# EAGLE design board_down (EAGLE 5.10)
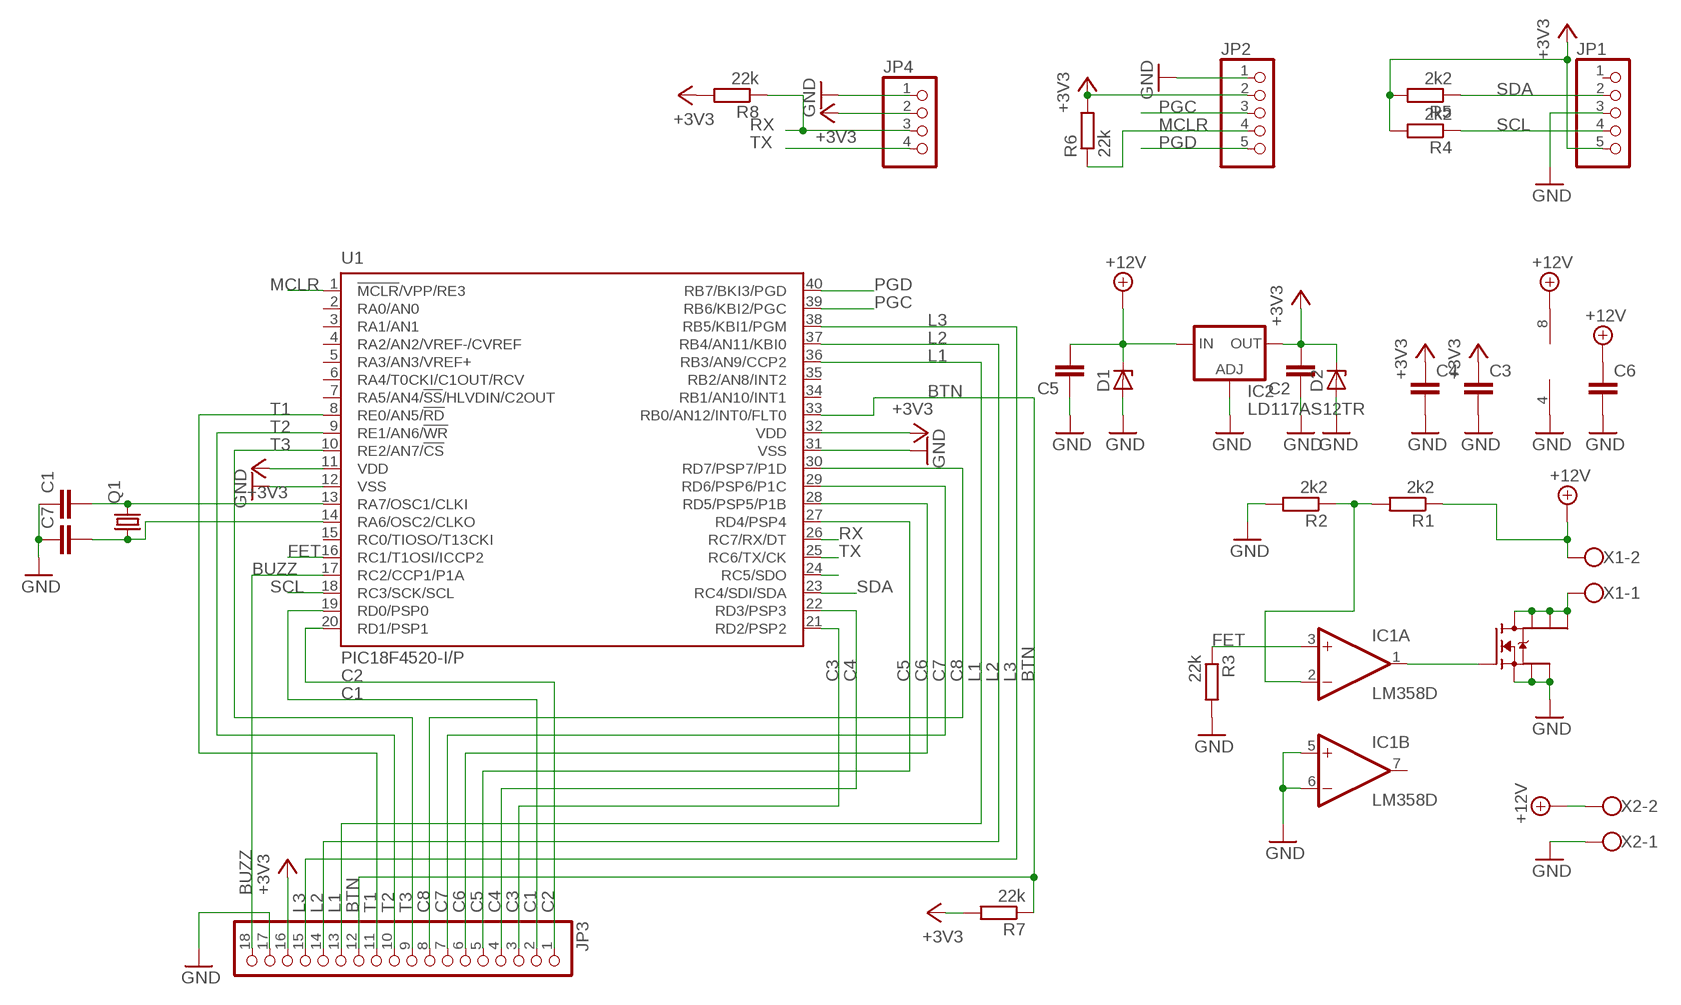
[diagram p0: schematic, sheet 1]

## Parts
C1  C-EUC0805  [C0805]
C2  C-EUC1206  [C1206]
C3  C-EUC0805  [C0805]
C4  C-EUC0805  [C0805]
C5  C-EUC1206  [C1206]
C6  C-EUC0805  [C0805]
C7  C-EUC0805  [C0805]
D1  ZENER-DIODESMB  [SMB]
D2  ZENER-DIODESMB  [SMB]
IC1  LM358D  [SO08]
IC2  LD117AS12TR  [SOT223]
JP1  PINHD-1X5  [1X05]
JP2  PINHD-1X5  [1X05]
JP3  PINHD-1X18  [1X18]
JP4  PINHD-1X4  [1X04]
Q1  CRYSTALHC49S  [HC49/S]
R1  2k2  R-EU_R0805  [R0805]
R2  2k2  R-EU_R0805  [R0805]
R3  22k  R-EU_R0805  [R0805]
R4  2k2  R-EU_R0805  [R0805]
R5  2k2  R-EU_R0805  [R0805]
R6  22k  R-EU_R0805  [R0805]
R7  22k  R-EU_R0805  [R0805]
R8  22k  R-EU_R0805  [R0805]
U1  PIC18F4520-I/P  [DIL40]
U$1  IRF8788  [SO8]
X1  W237-02P  [W237-132]
X2  W237-02P  [W237-132]

## Nets
+3V3: C2.2 C3.1 C4.1 D2.C IC2.4(OUT) JP1.5 JP2.2 JP3.16 JP4.2 R4.2 R5.2 R6.2 R7.2 R8.2 U1.11(VDD) U1.32(VDD)
+12V: C5.2 C6.1 D1.C IC1.8(P:V+) IC2.3(IN) R1.1 X1.2 X2.2
BTN: JP3.12 R7.1 U1.33(RB0/AN12/INT0/FLT0)
BUZZ: JP3.18 U1.17(RC2/CCP1/P1A)
C1: JP3.2 U1.19(RD0/PSP0)
C2: JP3.1 U1.20(RD1/PSP1)
C3: JP3.3 U1.21(RD2/PSP2)
C4: JP3.4 U1.22(RD3/PSP3)
C5: JP3.5 U1.27(RD4/PSP4)
C6: JP3.6 U1.28(RD5/PSP5/P1B)
C7: JP3.7 U1.29(RD6/PSP6/P1C)
C8: JP3.8 U1.30(RD7/PSP7/P1D)
FET: IC1.3(A:+IN) R3.1 U1.16(RC1/T1OSI/ICCP2)
GND: C1.1 C2.1 C3.2 C4.2 C5.1 C6.2 C7.1 D1.A D2.A IC1.4(P:V-) IC1.5(B:+IN) IC1.6(B:-IN) IC2.1(ADJ) JP1.3 JP2.1 JP3.17 JP4.1 R2.2 R3.2 U1.12(VSS) U1.31(VSS) U$1.1(S1) U$1.2(S2) U$1.3(S3) X2.1
L1: JP3.13 U1.36(RB3/AN9/CCP2)
L2: JP3.14 U1.37(RB4/AN11/KBI0)
L3: JP3.15 U1.38(RB5/KBI1/PGM)
MCLR: JP2.4 R6.1 U1.1(!MCLR!/VPP/RE3)
N$1: U1.24(RC5/SDO)
N$2: U$1.5(D4) U$1.6(D3) U$1.7(D2) U$1.8(D1) X1.1
N$3: IC1.1(A:OUT) U$1.4(G)
N$5: IC1.2(A:-IN) R1.2 R2.1
N$20: C1.2 Q1.2 U1.13(RA7/OSC1/CLKI)
N$21: C7.2 Q1.1 U1.14(RA6/OSC2/CLKO)
PGC: JP2.3 U1.39(RB6/KBI2/PGC)
PGD: JP2.5 U1.40(RB7/BKI3/PGD)
RX: JP4.3 R8.1 U1.26(RC7/RX/DT)
SCL: JP1.4 R4.1 U1.18(RC3/SCK/SCL)
SDA: JP1.2 R5.1 U1.23(RC4/SDI/SDA)
T1: JP3.11 U1.8(RE0/AN5/!RD)
T2: JP3.10 U1.9(RE1/AN6/!WR)
T3: JP3.9 U1.10(RE2/AN7/!CS)
TX: JP4.4 U1.25(RC6/TX/CK)
Unconnected: IC1.7(B:OUT) JP1.1 U1.2(RA0/AN0) U1.3(RA1/AN1) U1.4(RA2/AN2/VREF-/CVREF) U1.5(RA3/AN3/VREF+) U1.6(RA4/T0CKI/C1OUT/RCV) U1.7(RA5/AN4/!SS!/HLVDIN/C2OUT) U1.15(RC0/TIOSO/T13CKI) U1.34(RB1/AN10/INT1) U1.35(RB2/AN8/INT2)

## Library data of the parts
C1-C7 = rcl:C-EU: CAPACITOR, European symbol
D1 D2 = diode:ZENER-DIODE: Z-Diode
IC1 = linear:LM358: OP AMP also LM158; LM258; LM2904 Source: http://cache.national.com/ds/LM/LM158.pdf
IC2 = v-reg:LD117A?*: Low drop fixed and adjustable positive voltage regulators 1 A Source: http://www.st.com/stonline/products/literature/ds/7194/ld1117axx.pdf
JP1 JP2 = pinhead:PINHD-1X5: PIN HEADER
JP3 = pinhead:PINHD-1X18: PIN HEADER
JP4 = pinhead:PINHD-1X4: PIN HEADER
Q1 = crystal:CRYSTAL: CRYSTAL
R1-R8 = rcl:R-EU_: RESISTOR, European symbol
U1 = microchip-pic18:PIC18F4*20: Microcontrollers with nanoWatt Technology High-Performance, Enhanced Flash, 28/40/44-Pin,
U$1 = _moja:IRF8788
X1 X2 = con-wago-508:W237-02P: WAGO SREW CLAMP

## Board
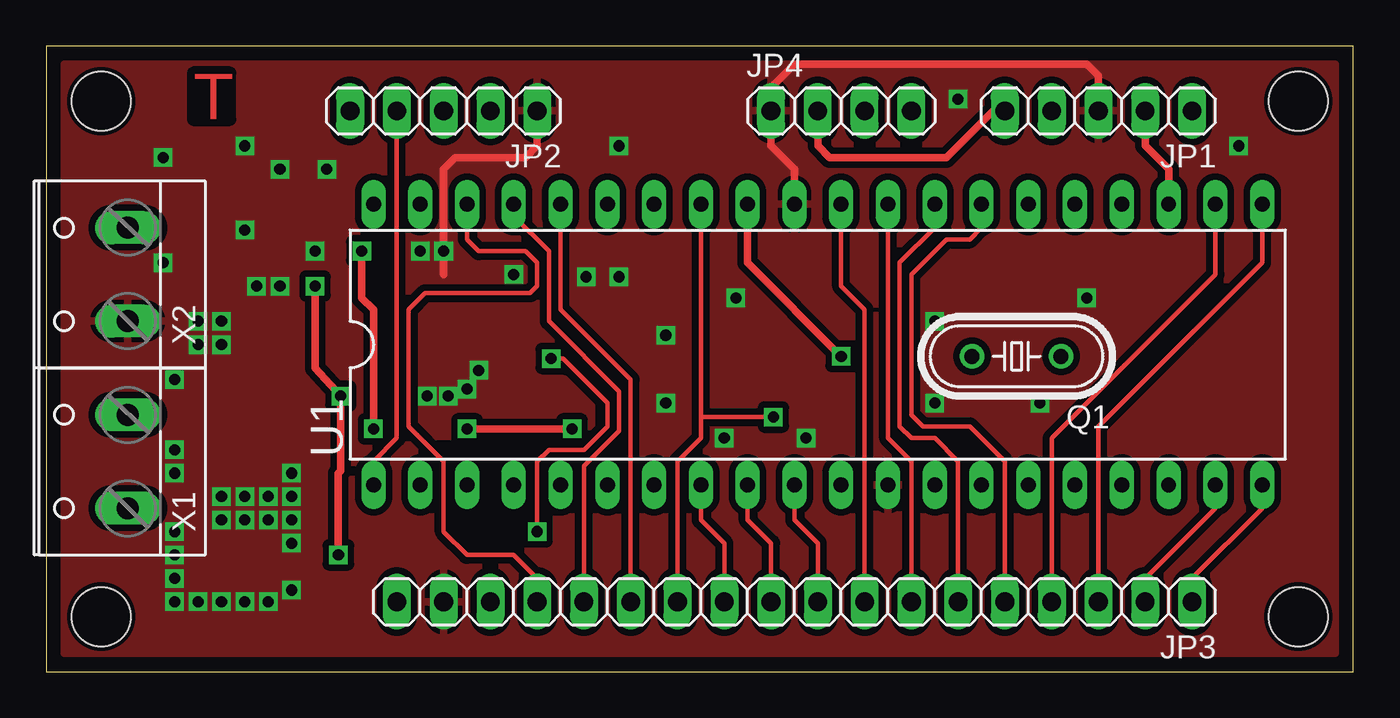
[diagram p1: board, top side]
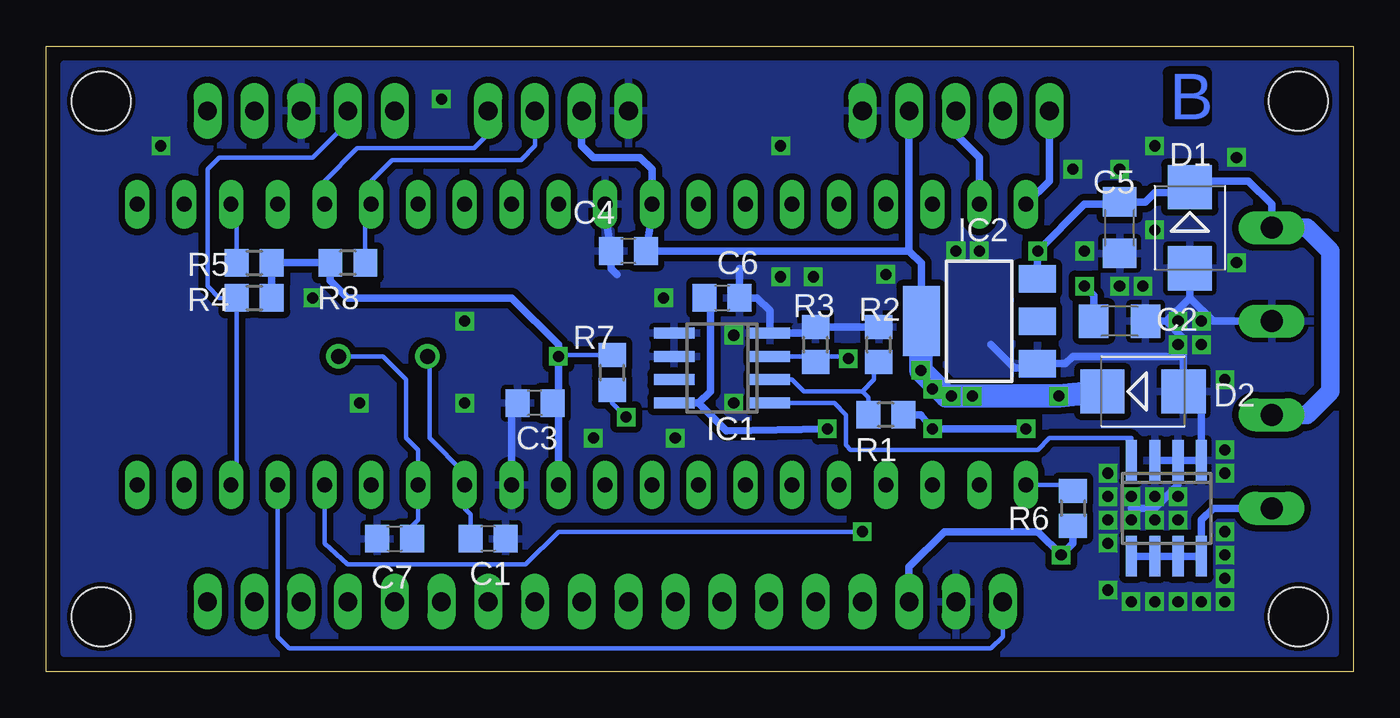
[diagram p2: board, bottom side, seen from below]

Size 71 x 34 mm. Coordinates in mm from the lower left corner, seen from the top.
Outline: 0,0 71,0 71,34 0,34 0,0
Copper layers (1*16): Top 0.035mm / dielectric 1.5mm / Bottom 0.035mm
Design rules "default *": minimum track width 8mil, minimum drill 23mil, track to track 14mil, track to pad 14mil, pad to pad 14mil, via to via 14mil, smd to smd 8mil, copper to edge 10mil, drill to drill 8mil, minimum pad ring 10mil, minimum via ring 8mil, stop-mask expansion 4mil, vias tented up to drill 0mil, thermal gap 10mil
Holes 3.2 mm at 3,3 68,3 3,31 68,31

### Footprints (pad centres in the part's own frame; a part is rotated, then mirrored left to right if it is on the bottom)
C0805 = smd 1.3 x 1.5: 1 -0.95,0; 2 0.95,0
C1206 = smd 1.6 x 1.8: 1 -1.4,0; 2 1.4,0
SMB = smd 2.4 x 2.4: A 2.2,0; C -2.2,0
SO08 = smd 0.6 x 2.2: 1 -1.905,-2.6; 2 -0.635,-2.6; 3 0.635,-2.6; 4 1.905,-2.6; 5 1.905,2.6; 6 0.635,2.6; 7 -0.635,2.6; 8 -1.905,2.6
SOT223 = smd 1.5 x 2: 1 -2.3,-3.15; 2 0,-3.15; 3 2.3,-3.15 | smd 3.8 x 2: 4 0,3.15
1X05 = drill 1.016 long: 1 -5.08,0; 2 -2.54,0; 3 0,0; 4 2.54,0; 5 5.08,0
1X18 = drill 1.016 long: 1 -21.59,0; 2 -19.05,0; 3 -16.51,0; 4 -13.97,0; 5 -11.43,0; 6 -8.89,0; 7 -6.35,0; 8 -3.81,0; 9 -1.27,0; 10 1.27,0; 11 3.81,0; 12 6.35,0; 13 8.89,0; 14 11.43,0; 15 13.97,0; 16 16.51,0; 17 19.05,0; 18 21.59,0
1X04 = drill 1.016 long: 1 -3.81,0; 2 -1.27,0; 3 1.27,0; 4 3.81,0
HC49/S = drill 0.813 round: 1 -2.413,0; 2 2.413,0
R0805 = smd 1.3 x 1.5: 1 -0.95,0; 2 0.95,0
DIL40 = drill 0.813 long: 1 -24.13,-7.62; 2 -21.59,-7.62; 3 -19.05,-7.62; 4 -16.51,-7.62; 5 -13.97,-7.62; 6 -11.43,-7.62; 7 -8.89,-7.62; 8 -6.35,-7.62; 9 -3.81,-7.62; 10 -1.27,-7.62; 11 1.27,-7.62; 12 3.81,-7.62; 13 6.35,-7.62; 14 8.89,-7.62; 15 11.43,-7.62; 16 13.97,-7.62; 17 16.51,-7.62; 18 19.05,-7.62; 19 21.59,-7.62; 20 24.13,-7.62; 21 24.13,7.62; 22 21.59,7.62; 23 19.05,7.62; 24 16.51,7.62; 25 13.97,7.62; 26 11.43,7.62; 27 8.89,7.62; 28 6.35,7.62; 29 3.81,7.62; 30 1.27,7.62; 31 -1.27,7.62; 32 -3.81,7.62; 33 -6.35,7.62; 34 -8.89,7.62; 35 -11.43,7.62; 36 -13.97,7.62; 37 -16.51,7.62; 38 -19.05,7.62; 39 -21.59,7.62; 40 -24.13,7.62
SO8 = smd 0.6 x 2.2: 1 -1.905,-2.6; 2 -0.635,-2.6; 3 0.635,-2.6; 4 1.905,-2.6; 5 1.905,2.6; 6 0.635,2.6; 7 -0.635,2.6; 8 -1.905,2.6
W237-132 = drill 1.194 long: 1 -2.54,-0.635; 2 2.54,-0.635

### Placement (x,y rotation side)
C1  46.99,7.24 180 bottom
C2  12.7,19.05 180 bottom
C3  44.45,14.61 180 bottom
C4  39.37,22.86 180 bottom
C5  12.7,24.13 90 bottom
C6  34.29,20.32 0 bottom
C7  52.07,7.24 0 bottom
D1  8.89,24.13 270 bottom
D2  11.43,15.24 0 bottom
IC1  34.29,16.51 90 bottom
IC2  20.32,19.05 90 bottom
JP1  57.15,30.48 180 top
JP2  21.59,30.48 180 top
JP3  40.64,3.81 180 top
JP4  43.18,30.48 0 top
Q1  52.7,17.14 180 top
R1  25.4,13.97 180 bottom
R2  25.78,17.78 90 bottom
R3  29.21,17.78 90 bottom
R4  59.69,20.32 0 bottom
R5  59.69,22.23 0 bottom
R6  15.24,8.89 270 bottom
R7  40.26,16.26 90 bottom
R8  54.61,22.23 180 bottom
U1  41.91,17.78 0 top
U$1  10.16,8.89 180 bottom
X1  3.81,11.43 90 top
X2  3.81,21.59 90 top

### Tracks (layer width: path | path; a pad name or v marks a point on that pad's centre or on a via)
+3V3  (via drill 0.6)
  Top 0.406: v14.61,20.95 14.61,16.51 v16,14.99 16,10.92 15.88,10.79 v15.88,6.35 | U1.32 38.1,22.23 v43.18,17.14 | JP1.5 51.44,30.48 48.9,27.94 42.55,27.94 41.91,28.57 JP4.2
  Bottom 0.254: R7.2 43.12,17.21 v43.18,17.14 | v21.84,14.99 22.86,14.99 v22.86,15.37
  Bottom 0.406: 23.5,19.02 IC2.4 23.47,22.2 24.13,22.86 | C2.2 14.1,20.45 v14.61,20.95 | 24.13,22.86 C4.1 | C4.1 38.1,23.18 | U1.11 43.18,14.29 C3.1 43.18,14.93 v43.18,17.14 43.18,17.78 45.72,20.32 54.61,20.32 55.56,21.27 R8.2 R5.2 R4.2 | C4.1 38.17,24.32 U1.32 38.1,27.3 38.73,27.94 41.27,27.94 41.91,28.57 JP4.2 | JP3.16 24.13,5.71 22.23,7.62 17.14,7.62 v15.88,6.35 15.24,6.99 R6.2 | 24.13,22.86 JP2.2
  Bottom 1.27: D2.C v16,14.99 v20.7,14.99 v21.84,14.99 22.1,14.99 v23.5,16.38 23.5,19.02
  pour Top: 20.83,20.19 20.32,19.68 20.32,12.7 29.72,12.7 29.72,14.48 28.19,16 28.07,16 27.81,16.26 27.81,19.94 27.56,20.19
+12V  (via drill 0.6)
  Top 0.406: v17.78,13.21 17.78,19.68 17.14,20.32 v17.14,22.86 | v22.86,13.21 v28.57,13.21
  Bottom 0.406: X2.2 4.45,25.4 5.71,26.67 8.55,26.67 D1.C 9.19,26.04 10.79,26.04 11.3,25.53 C5.2 13.21,25.4 14.61,25.4 v17.14,22.86 17.17,22.84 IC2.3 | 35.56,14.61 IC1.8 | 35.56,14.61 34.92,15.24 34.92,20 C6.1 | v17.78,13.21 v22.86,13.21 23.5,13.97 R1.1 | v28.57,13.21 34.04,13.08 35.56,14.61
  Bottom 1.016: X2.2 2.54,24.13 1.27,22.86 1.27,15.24 2.54,13.97 X1.2
BTN  (via drill 0.6)
  Top 0.254: 35.56,13.84 35.56,12.7 34.29,11.43 JP3.12 | 35.56,13.84 U1.33 | 35.56,13.84 v39.5,13.84
  Bottom 0.254: R7.1 40.26,14.61 v39.5,13.84
BUZZ
  Bottom 0.254: JP3.18 19.05,1.91 19.68,1.27 57.78,1.27 58.42,1.91 U1.17
C1
  Top 0.254: U1.19 63.5,8.89 59.69,5.08 JP3.2
C2
  Top 0.254: U1.20 66.04,8.89 62.23,5.08 JP3.1
C3
  Top 0.254: U1.21 66.04,22.23 57.15,13.34 JP3.3
C4
  Top 0.254: U1.22 63.5,21.59 54.61,12.7 JP3.4
C5
  Top 0.254: U1.27 50.8,24.13 50.16,23.5 48.9,23.5 46.99,21.59 46.99,13.97 47.62,13.34 50.16,13.34 50.8,12.7 52.07,11.43 JP3.5
C6
  Top 0.254: U1.28 48.26,24.13 46.35,22.23 46.35,13.34 46.99,12.7 48.26,12.7 49.53,11.43 JP3.6
C7
  Top 0.254: U1.29 45.72,12.7 46.99,11.43 JP3.7
C8
  Top 0.254: U1.30 43.18,20.95 44.45,19.68 JP3.8
FET  (via drill 0.6)
  Top 0.254: v27.43,17.02 28.07,17.02 30.48,14.61 30.48,13.34 29.21,12.06 27.3,12.06 26.67,11.43 v26.67,7.62
  Bottom 0.254: v27.43,17.02 27.43,17.14 29.52,17.14 IC1.3 | v26.67,7.62 43.18,7.62 44.96,5.84 54.61,5.84 55.88,6.99 U1.16
  Bottom 0.406: 29.52,17.14 R3.1
GND  (via drill 0.6)
  Top 0.406: U1.31 40.64,27.3 39.37,28.57 JP4.1 39.37,31.75 40.64,33.02 56.52,33.02 57.15,32.38 JP1.3 | JP2.1 26.67,28.57 26.04,27.94 22.23,27.94 21.59,27.3 21.59,21.59
  Bottom 0.406: X2.1 7.62,19.05 8.89,20.32 | 8.89,20.32 D1.A | 10.16,19.05 C2.1 | 10.16,19.05 8.89,20.32 | 9.23,17.14 D2.A 8.26,14.27 U$1.1 U$1.2 | 9.23,17.14 9.23,18.12 10.16,19.05 | U$1.2 U$1.3 | 9.23,17.14 15.24,17.14 15.63,16.75 IC2.1 17.41,16.51 18.41,16.51 19.68,17.78 | 40.01,21.59 40.32,21.91 C4.2 40.57,24.45 U1.31 | 33.34,21.91 C6.2 32.38,20.32 31.69,19.62 IC1.4 29.52,18.41 R3.2 R2.2 | U1.12 45.72,14.29 C3.2 | 12.06,8.89 10.79,8.89 9.53,10.16 U$1.2
  other vias: 25.4,21.59 20.32,22.86 9.53,9.53 10.79,9.53 12.06,9.53 13.34,9.53 13.34,10.79 6.99,15.88 8.26,17.78 9.53,19.05 11.43,20.95 12.7,20.95 15.24,27.3 12.7,27.3 10.79,28.57 6.35,27.94 14.61,22.86 31.11,28.57 31.11,21.46 37.47,20.32 36.83,12.7 41.27,12.7 48.26,19.05 48.26,14.61 53.98,14.61 56.52,20.32 49.53,31.11 64.77,28.57 9.53,3.81 12.06,3.81 10.79,3.81 13.34,4.45 13.34,6.99 13.34,8.26 12.06,8.26 10.79,8.26 8.26,3.81 6.99,3.81 6.99,5.08 6.99,6.35 6.99,7.62 9.53,8.26 6.99,10.79 6.99,12.06 33.66,14.61 9.53,17.78 8.26,19.05 6.35,22.23 21.59,22.86 33.66,18.29 29.34,21.46 10.79,24
  pour Bottom: 1,33 1,1 70,1 70,33
  pour Top (rank 2): 1,33 1,1 70,1 70,33
L1
  Top 0.254: U1.36 27.94,19.68 31.75,15.88 JP3.13
L2
  Top 0.254: U1.37 25.4,24.77 27.3,22.86 27.3,19.05 31.11,15.24 31.11,13.08 29.21,11.18 JP3.14
L3
  Top 0.254: U1.38 22.86,23.5 23.5,22.86 26.04,22.86 26.67,22.23 26.67,20.95 26.29,20.57 20.57,20.57 19.68,19.68 19.68,13.34 21.59,11.43 21.59,7.62 22.86,6.35 25.4,6.35 26.67,5.08 JP3.15
MCLR
  Top 0.254: JP2.4 19.05,12.7 17.78,11.43 U1.1
  Bottom 0.254: 15.56,10.16 U1.1
  Bottom 0.406: R6.1 15.56,10.16
N$2
  Bottom 0.406: U$1.5 U$1.6 U$1.7 U$1.8 8.26,8.26 7.62,8.89 X1.1
N$3
  Bottom 0.254: IC1.1 28.19,14.61 27.56,13.97 27.56,12.32 27.3,12.06 17.14,12.06 16.51,12.7 12.06,12.7 U$1.4
N$5
  Bottom 0.254: IC1.2 30.48,15.88 29.84,15.24 26.67,15.24 | 26.67,15.24 26.04,15.88 26.04,16.58 R2.1 | R1.2 26.35,14.92 26.67,15.24
N$20
  Bottom 0.254: C1.2 47.94,8.57 48.26,8.89 U1.13 48.26,10.79 50.16,12.7 50.16,17.02
  Bottom 0.406: 50.16,17.02 Q1.2
N$21
  Bottom 0.254: C7.2 51.12,7.93 50.8,8.26 U1.14 50.8,12.06 51.44,12.7 51.44,15.88 52.7,17.14 Q1.1
PGC
  Bottom 0.406: JP2.3 21.59,29.21 20.32,27.94 U1.39
PGD
  Bottom 0.406: JP2.5 16.51,26.67 U1.40
RX
  Bottom 0.254: JP4.3 44.45,28.57 45.21,27.81 52.2,27.81 53.34,26.67 U1.26 53.66,25.08 R8.1
SCL
  Bottom 0.254: U1.18 60.64,10.48 R4.1 61.59,20.32 62.23,20.95 62.23,27.3 61.59,27.94 56.52,27.94 54.61,29.84 JP1.4
SDA
  Top 0.406: JP1.2 59.69,28.57 60.96,27.3 U1.23
  Bottom 0.254: R5.1 60.64,25.08 U1.23
T1
  Top 0.254: U1.8 35.56,8.26 36.83,6.99 JP3.11
T2
  Top 0.254: U1.9 38.1,8.26 39.37,6.99 JP3.10
T3
  Top 0.254: U1.10 40.64,8.26 41.91,6.99 JP3.9
TX
  Bottom 0.254: JP4.4 46.99,29.21 47.75,28.45 54.1,28.45 55.88,26.67 U1.25

### Text on the board
Top: T
Bottom: B